# Altium schematic sheet demod_blank.SchDoc
size Letter; SheetNumber: 13; SheetTotal: 13
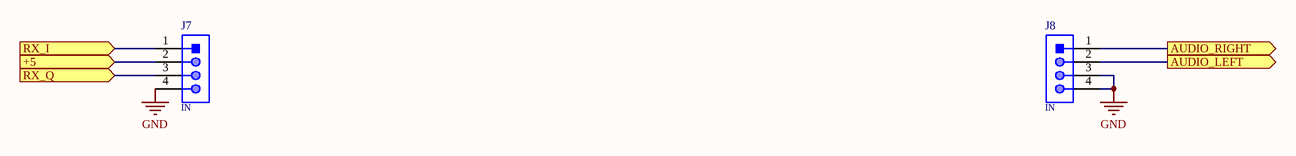
[diagram p0: demod_blank.SchDoc]

## Parts
J7  IN  [61300411121]
J8  IN  [61300411121]

## Ports
+5 (in), AUDIO_LEFT (out), AUDIO_RIGHT (out), RX_I (in), RX_Q (in)

## Nets
GND: J7.4 J8.3 J8.4
+5: J7.2 ; port +5
AUDIO_LEFT: J8.2 ; port AUDIO_LEFT
AUDIO_RIGHT: J8.1 ; port AUDIO_RIGHT
RX_I: J7.1 ; port RX_I
RX_Q: J7.3 ; port RX_Q

## Library data of the parts
J7 J8 = CMP-1502-01064-1: THT Vertical Pin Header WR-PHD, Pitch 2.54 mm, Single Row, 4 pins; Manufacturer: Wurth Elektronik; Withstanding Voltage: 500VAC; Rated Current: 3A; Working Voltage: 250VAC; Pin Number: 4; Gender: Male; Contact Resistance: 20mOhm; Pitch: 2.54mm; Manufacturer URL: http://www.we-online.de; Operating Temperature: -40to105degC; Packaging: Bag; Mounting Technology: THT; Package Reference: 61300411121; Datasheet URL: https://katalog.we-online.de/em/datasheet/6130xx11121.pdf; Publisher: WurthElektronik; Part Number: 61300411121; Row Number: Single; Orientation: Vertical